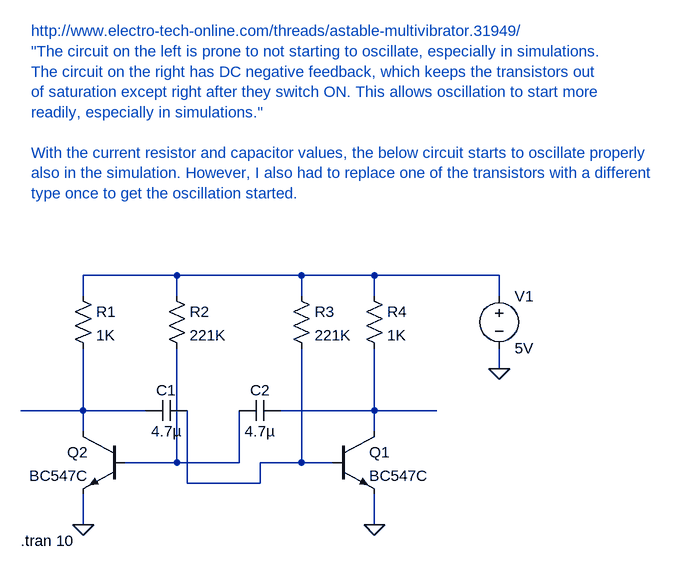
[diagram p0: schematic AstabMultivib.asc]
AstabMultivib.asc, the LTspice schematic file:
Version 4
SHEET 1 980 680
WIRE 32 -128 -112 -128
WIRE 224 -128 32 -128
WIRE 336 -128 224 -128
WIRE 528 -128 336 -128
WIRE -112 -96 -112 -128
WIRE 32 -96 32 -128
WIRE 224 -96 224 -128
WIRE 336 -96 336 -128
WIRE 528 -96 528 -128
WIRE 528 16 528 -16
WIRE -112 80 -112 -16
WIRE -112 80 -208 80
WIRE -16 80 -112 80
WIRE 336 80 336 -16
WIRE 336 80 192 80
WIRE 432 80 336 80
WIRE -112 112 -112 80
WIRE 336 112 336 80
WIRE 32 160 32 -16
WIRE 32 160 -48 160
WIRE 128 160 128 80
WIRE 128 160 32 160
WIRE 224 160 224 -16
WIRE 224 160 160 160
WIRE 272 160 224 160
WIRE 48 192 48 80
WIRE 160 192 160 160
WIRE 160 192 48 192
WIRE -112 256 -112 208
WIRE 336 256 336 208
FLAG -112 256 0
FLAG 336 256 0
FLAG 528 16 0
SYMBOL npn -48 112 M0
SYMATTR InstName Q2
SYMATTR Value BC547C
SYMBOL res -128 -112 R0
SYMATTR InstName R1
SYMATTR Value 1K
SYMATTR SpiceLine tol=1 pwr=0.1
SYMBOL res 16 -112 R0
SYMATTR InstName R2
SYMATTR Value 221K
SYMATTR SpiceLine tol=1 pwr=0.1
SYMBOL res 208 -112 R0
SYMATTR InstName R3
SYMATTR Value 221K
SYMATTR SpiceLine tol=1 pwr=0.1
SYMBOL res 320 -112 R0
SYMATTR InstName R4
SYMATTR Value 1K
SYMATTR SpiceLine tol=1 pwr=0.1
SYMBOL cap 48 64 R90
WINDOW 0 0 32 VBottom 2
WINDOW 3 32 32 VTop 2
SYMATTR InstName C1
SYMATTR Value 4.7µ
SYMATTR SpiceLine V=16 Irms=4.27 Rser=0.0182602 Lser=0 mfg="KEMET" pn="C1206C475K4PAC" type="X5R"
SYMBOL cap 128 96 R270
WINDOW 0 32 32 VTop 2
WINDOW 3 0 32 VBottom 2
SYMATTR InstName C2
SYMATTR Value 4.7µ
SYMATTR SpiceLine V=25 Irms=9.88 Rser=0.00384339 Lser=0 mfg="KEMET" pn="C0805C475K3PAC" type="X5R"
SYMBOL voltage 528 -112 R0
WINDOW 123 0 0 Left 2
WINDOW 39 0 0 Left 2
SYMATTR InstName V1
SYMATTR Value 5V
SYMBOL npn 272 112 R0
SYMATTR InstName Q1
SYMATTR Value BC547C
TEXT -208 280 Left 2 !.tran 10
TEXT -192 -504 Left 2 ;http://www.electro-tech-online.com/threads/astable-multivibrator.31949/\n"The circuit on the left is prone to not starting to oscillate, especially in simulations. \nThe circuit on the right has DC negative feedback, which keeps the transistors out \nof saturation except right after they switch ON. This allows oscillation to start more \nreadily, especially in simulations."\n \nWith the current resistor and capacitor values, the below circuit starts to oscillate properly\nalso in the simulation. However, I also had to replace one of the transistors with a different\ntype once to get the oscillation started.

The netlist it stands for:
* AstabMultivib.asc
Q2 N002 N004 0 0 BC547C
R1 N001 N002 1K tol=1 pwr=0.1
R2 N001 N004 221K tol=1 pwr=0.1
R3 N001 N005 221K tol=1 pwr=0.1
R4 N001 N003 1K tol=1 pwr=0.1
C1 N005 N002 4.7µ V=16 Irms=4.27 Rser=0.0182602 Lser=0 mfg="KEMET" pn="C1206C475K4PAC" type="X5R"
C2 N004 N003 4.7µ V=25 Irms=9.88 Rser=0.00384339 Lser=0 mfg="KEMET" pn="C0805C475K3PAC" type="X5R"
V1 N001 0 5V
Q1 N003 N005 0 0 BC547C
.model NPN NPN
.model PNP PNP
.lib standard.bjt
.tran 10
* http://www.electro-tech-online.com/threads/astable-multivibrator.31949/
* "The circuit on the left is prone to not starting to oscillate, especially in simulations.
* The circuit on the right has DC negative feedback, which keeps the transistors out
* of saturation except right after they switch ON. This allows oscillation to start more
* readily, especially in simulations."
* With the current resistor and capacitor values, the below circuit starts to oscillate properly
* also in the simulation. However, I also had to replace one of the transistors with a different
* type once to get the oscillation started.
.backanno
.end